# Altium schematic sheet MAIN.SchDoc
size A4; SheetNumber: 2; SheetTotal: 3
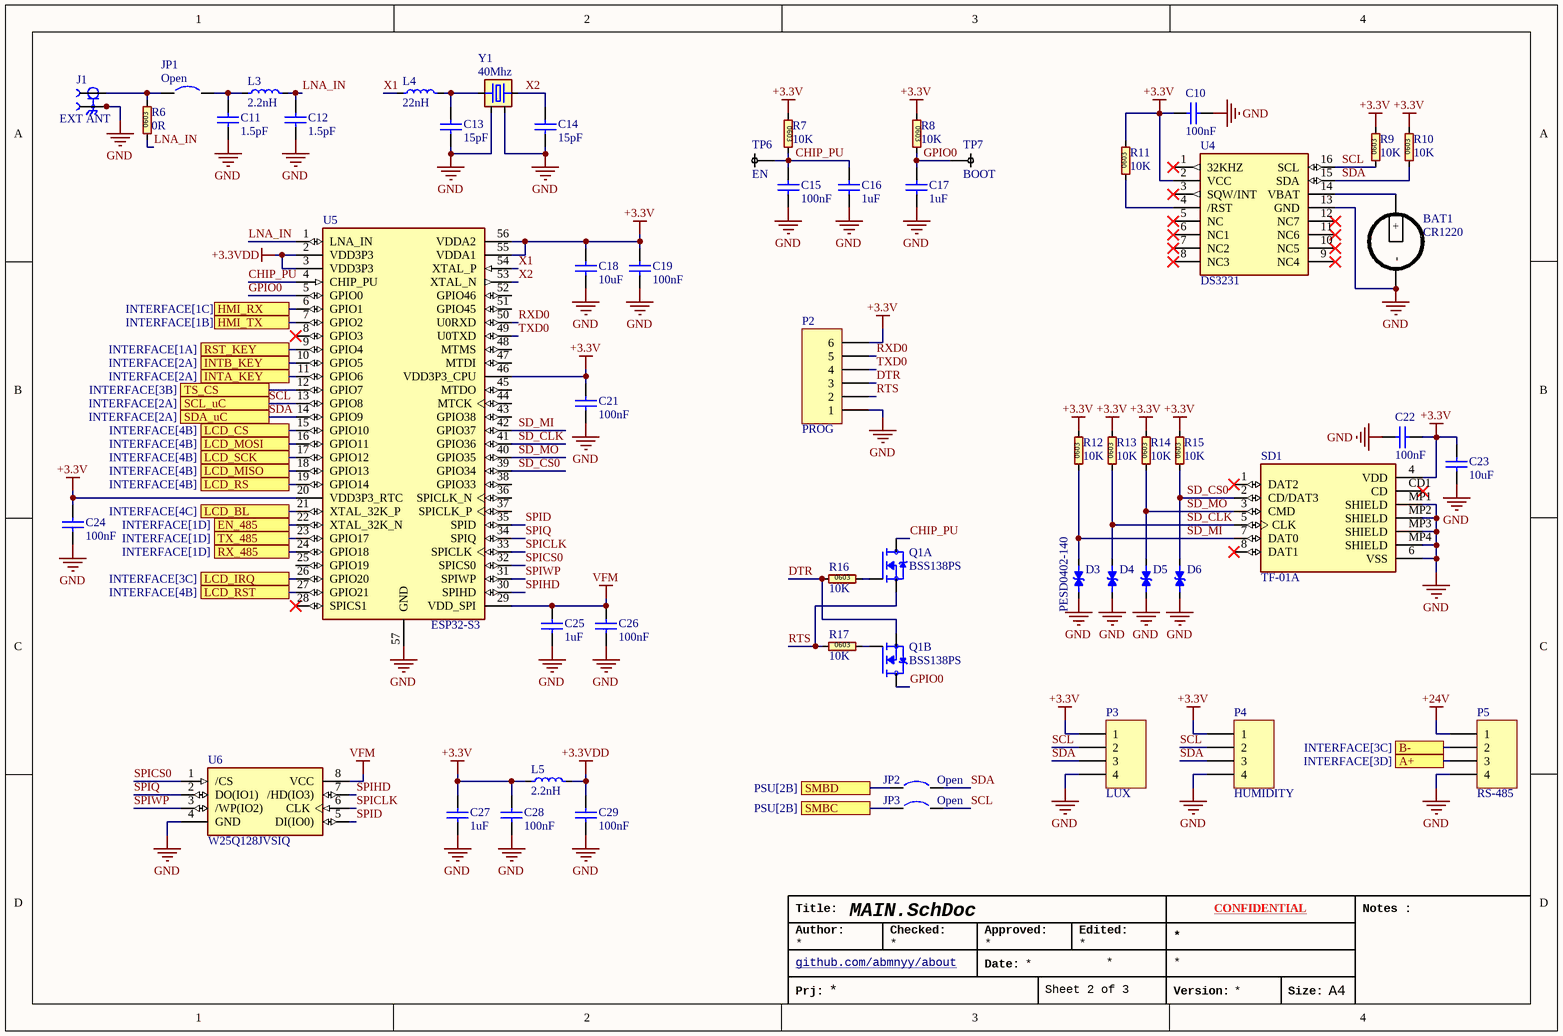
[diagram p0: MAIN.SchDoc]

## Parts
BAT1  CR1220  [MPD_BC501SM-TR]
C10  100nF  [C0603]
C11  1.5pF  [C0603]
C12  1.5pF  [C0603]
C13  15pF  [C0603]
C14  15pF  [C0603]
C15  100nF  [C0603]
C16  1uF  [C0603]
C17  1uF  [C0603]
C18  10uF  [C0603]
C19  100nF  [C0603]
C21  100nF  [C0603]
C22  100nF  [C0603]
C23  10uF  [C0603]
C24  100nF  [C0603]
C25  1uF  [C0603]
C26  100nF  [C0603]
C27  1uF  [C0603]
C28  100nF  [C0603]
C29  100nF  [C0603]
D3  PESD0402-140  [ESD0402]
D4  PESD0402-140  [ESD0402]  (value not drawn)
D5  PESD0402-140  [ESD0402]  (value not drawn)
D6  PESD0402-140  [ESD0402]  (value not drawn)
J1  EXT ANT  [IPEX_UF.L]
JP1  Open  [SB_STM]
JP2  Open  [SB_STM]
JP3  Open  [SB_STM]
L3  2.2nH  [L0603]
L4  22nH  [L0603]
L5  2.2nH  [L0603]
P2  PROG  [HDR-6P-2.54mm]
P3  LUX  [JST_XH-2.54]
P4  HUMIDITY  [JST_XH-2.54]
P5  RS-485  [JST_XH-2.54]
Q1  BSS138PS  [SOT-363]  (parts A,B of 2)
R6  0R  [R0603]
R7  10K  [R0603]
R8  10K  [R0603]
R9  10K  [R0603]
R10  10K  [R0603]
R11  10K  [R0603]
R12  10K  [R0603]
R13  10K  [R0603]
R14  10K  [R0603]
R15  10K  [R0603]
R16  10K  [R0603]
R17  10K  [R0603]
SD1  TF-01A  [TF-01A]
TP6  EN  [PAD]
TP7  BOOT  [PAD]
U4  DS3231  [SOIC-16-WIDE]
U5  ESP32-S3  [ESP32-S3]
U6  W25Q128JVSIQ  [SOIC-8-208miL]
Y1  40Mhz  [OSC_SMD3225-4]

## Ports
A+ (see INTERFACE[3D]), B- (see INTERFACE[3C]), EN_485 (see INTERFACE[1D]), HMI_RX (see INTERFACE[1C]), HMI_TX (see INTERFACE[1B]), INTA_KEY (see INTERFACE[2A]), INTB_KEY (see INTERFACE[2A]), LCD_BL (see INTERFACE[4C]), LCD_CS (see INTERFACE[4B]), LCD_IRQ (see INTERFACE[3C]), LCD_MISO (see INTERFACE[4B]), LCD_MOSI (see INTERFACE[4B]), LCD_RS (see INTERFACE[4B]), LCD_RST (see INTERFACE[4B]), LCD_SCK (see INTERFACE[4B]), RST_KEY (see INTERFACE[1A]), RX_485 (see INTERFACE[1D]), SCL_uC (see INTERFACE[2A]), SDA_uC (see INTERFACE[2A]), SMBC (see PSU[2B]), SMBD (see PSU[2B]), TS_CS (see INTERFACE[3B]), TX_485 (see INTERFACE[1D])

## Nets
+3.3V: C10.2 C18.2 C19.2 C21.2 C22.1 C23.2 C24.2 C27.2 C28.2 L5.1 P2.6 P3.1 P4.1 R7.1 R8.1 R9.2 R10.2 R11.2 R12.2 R13.2 R14.2 R15.2 SD1.4(VDD) U4.2(VCC) U5.20(VDD3P3_RTC) U5.46(VDD3P3_CPU) U5.55(VDDA1) U5.56(VDDA2)
+3.3VDD: C29.2 L5.2 U5.2(VDD3P3) U5.3(VDD3P3)
+24V: P5.1
GND: BAT1.- C10.1 C11.1 C12.1 C13.1 C14.1 C15.2 C16.2 C17.2 C18.1 C19.1 C21.1 C22.2 C23.1 C24.1 C25.1 C26.1 C27.1 C28.1 C29.1 D3.1 D4.1 D5.1 D6.1 J1.2(GROUND) J1.3(GROUND) P2.1 P3.4 P4.4 P5.4 SD1.6(VSS) SD1.MP1(SHIELD) SD1.MP2(SHIELD) SD1.MP3(SHIELD) SD1.MP4(SHIELD) U4.13(GND) U5.57(GND) U6.4(GND) Y1.2(GND) Y1.4(GND)
VFM: C25.2 C26.2 U5.29(VDD_SPI) U6.8(VCC)
A+: P5.3 ; port A+
B-: P5.2 ; port B-
CHIP_PU: C15.1 C16.1 Q1.6(D1) R7.2 TP6.1 U5.4(CHIP_PU)
DTR: P2.3 Q1.4(S2) R16.1
EN_485: U5.22(XTAL_32K_N) ; port EN_485
GPIO0: C17.1 Q1.3(D2) R8.2 TP7.1 U5.5(GPIO0)
HMI_RX: U5.6(GPIO1) ; port HMI_RX
HMI_TX: U5.7(GPIO2) ; port HMI_TX
INTA_KEY: U5.11(GPIO6) ; port INTA_KEY
INTB_KEY: U5.10(GPIO5) ; port INTB_KEY
LCD_BL: U5.21(XTAL_32K_P) ; port LCD_BL
LCD_CS: U5.15(GPIO10) ; port LCD_CS
LCD_IRQ: U5.26(GPIO20) ; port LCD_IRQ
LCD_MISO: U5.18(GPIO13) ; port LCD_MISO
LCD_MOSI: U5.16(GPIO11) ; port LCD_MOSI
LCD_RS: U5.19(GPIO14) ; port LCD_RS
LCD_RST: U5.27(GPIO21) ; port LCD_RST
LCD_SCK: U5.17(GPIO12) ; port LCD_SCK
LNA_IN: C12.2 L3.2 R6.1 U5.1(LNA_IN)
RST_KEY: U5.9(GPIO4) ; port RST_KEY
RTS: P2.2 Q1.1(S1) R17.1
RX_485: U5.24(GPIO18) ; port RX_485
RXD0: P2.5 U5.50(U0RXD)
SCL: JP3.2 P3.2 P4.2 R9.1 U4.16(SCL) U5.13(GPIO8) ; port SCL_uC
SD_CLK: D4.2 R13.1 SD1.5(CLK) U5.41(GPIO36)
SD_CS0: D6.2 R15.1 SD1.2(CD/DAT3) U5.39(GPIO34)
SD_MI: D3.2 R12.1 SD1.7(DAT0) U5.42(GPIO37)
SD_MO: D5.2 R14.1 SD1.3(CMD) U5.40(GPIO35)
SDA: JP2.2 P3.3 P4.3 R10.1 U4.15(SDA) U5.14(GPIO9) ; port SDA_uC
SMBC: JP3.1 ; port SMBC
SMBD: JP2.1 ; port SMBD
SPICLK: U5.33(SPICLK) U6.6(CLK)
SPICS0: U5.32(SPICS0) U6.1(/CS)
SPID: U5.35(SPID) U6.5(DI(IO0))
SPIHD: U5.30(SPIHD) U6.7(/HD(IO3))
SPIQ: U5.34(SPIQ) U6.2(DO(IO1))
SPIWP: U5.31(SPIWP) U6.3(/WP(IO2))
TS_CS: U5.12(GPIO7) ; port TS_CS
TX_485: U5.23(GPIO17) ; port TX_485
TXD0: P2.4 U5.49(U0TXD)
X1: L4.1 U5.54(XTAL_P)
X2: C14.2 U5.53(XTAL_N) Y1.3(OSC2)
NetBAT1_+: BAT1.+ U4.14(VBAT)
NetC11_2: C11.2 JP1.2 L3.1
NetC13_2: C13.2 L4.2 Y1.1(OSC1)
NetJ1_1: J1.1(SIGNAL) JP1.1 R6.2
NetQ1_2: Q1.2(G1) R16.2
NetQ1_5: Q1.5(G2) R17.2
NetR11_1: R11.1 U4.4(/RST)

Not connected (* = marked no-connect by the designer): SD1 1(DAT2)* 8(DAT1)* CD1(CD)*; U4 1(32KHZ)* 3(SQW/INT)* 5(NC)* 6(NC1)* 7(NC2)* 8(NC3)* 9(NC4)* 10(NC5)* 11(NC6)* 12(NC7)*; U5 8(GPIO3)* 25(GPIO19) 28(SPICS1)* 36(SPICLK_N) 37(SPICLK_P) 38(GPIO33) 43(GPIO38) 44(MTCK) 45(MTDO) 47(MTDI) 48(MTMS) 51(GPIO45) 52(GPIO46)

## Notes on the sheet
- Title:
- Author:
- Checked:
- Approved:
- Edited:
- CONFIDENTIAL
- Notes :
- Prj:
- github.com/abmnyy/about <https://github.com/abmnyy/about>
- Date:
- Version:
- Size:
- A4
- (in symbol Resistor 0603 (Inch)) 0603

## Library data of the parts
BAT1 = CR1220 HOLDER: BATTERY HOLDER; MFR.Part #: BC501SM; LCSC Part #: C5439670; ComponentLink1Description: Datasheet; ComponentLink1URL: https://www.lcsc.com/datasheet/lcsc_datasheet_2410121528_MPD--Memory-Protection-Devices-BC501SM_C5439670.pdf
C10 C15 C19 C21-C29 = Capacitor 0603 (Inch): 0603 SMD Non-Polarity Capacitor; MFR.Part #: *; LCSC Part #: *; ComponentLink1Description: Datasheet; ComponentLink1URL: *
C11 C12 = Capacitor 0603 (Inch): 0603 SMD Non-Polarity Capacitor; MFR.Part #: CC0603CRNPO9BN1R5; LCSC Part #: C163551; ComponentLink1Description: Datasheet
  C11: ComponentLink1URL: https://www.lcsc.com/datasheet/C163551.pdf
  C12: ComponentLink1URL: *
C13 C14 = Capacitor 0603 (Inch): 0603 SMD Non-Polarity Capacitor; MFR.Part #: X322540MPB4SI; LCSC Part #: C9010; ComponentLink1Description: Datasheet
  C13: ComponentLink1URL: https://www.lcsc.com/datasheet/C9010.pdf
  C14: ComponentLink1URL: *
C16 C17 = Capacitor 0603 (Inch): 0603 SMD Non-Polarity Capacitor; MFR.Part #: CC0603KRX7R7BB105; LCSC Part #: C106248; ComponentLink1Description: Datasheet; ComponentLink1URL: *
C18 = Capacitor 0603 (Inch): 0603 SMD Non-Polarity Capacitor; MFR.Part #: CC0603MRX5R7BB106; LCSC Part #: C109457; ComponentLink1Description: Datasheet; ComponentLink1URL: *
D3-D6 = PESD0402-140: 40V Bidirectional 14V 0402 ESD and Surge Protection (TVS/ESD) ROHS; MFR.Part #: PESD0402-140; LCSC Part #: C10662
  D3: ComponentLink1Description: Datasheet; ComponentLink1URL: https://www.lcsc.com/datasheet/C10662.pdf
J1 = IPEX UF.L: 1 POS Vertical SMD Small form factor with big performance through 6 GHz connector,MHF, RF, micro-coaxial MHF I Receptacle; MFR.Part #: KH-IPEX-K501-29; LCSC Part #: C411563; ComponentLink1Description: Datasheet; ComponentLink1URL: https://www.lcsc.com/datasheet/C411563.pdf
JP1-JP3 = Jumper Solder: Jumper Solder Pad; Published: 24-Mar-1999; Revision: July-2002: Re-released for DXP Platform.; Publisher: Altium Limited
L3 = INDUCTOR 0603: Inductor with Package: 0603 Inch; MFR.Part #: *; LCSC Part #: *; ComponentLink1Description: Datasheet; ComponentLink1URL: *
L4 = INDUCTOR 0603: Inductor with Package: 0603 Inch; MFR.Part #: VHF160808H22NJT; LCSC Part #: C90207; ComponentLink1Description: Datasheet; ComponentLink1URL: https://www.lcsc.com/datasheet/C90207.pdf
L5 = INDUCTOR 0603: Inductor with Package: 0603 Inch; MFR.Part #: LQW18AN2N2C80D; LCSC Part #: C71648; ComponentLink1Description: Datasheet; ComponentLink1URL: https://www.lcsc.com/datasheet/C71648.pdf
P2 = Header 6: Header, 6-Pin; LatestRevisionDate: 17-Jul-2002; LatestRevisionNote: Re-released for DXP Platform.; Publisher: Altium Limited
P3-P5 = Connector 4P: CONNECTOR HEADER; LatestRevisionDate: 17-Jul-2002; LatestRevisionNote: Re-released for DXP Platform.; Publisher: Altium Limited
Q1 = BSS138PS: 60 V, 320 mA dual N-channel Trench MOSFET; MFR.Part #: BSS138PS,115; LCSC Part #: C193381; ComponentLink1Description: Datasheet; ComponentLink1URL: https://www.lcsc.com/datasheet/lcsc_datasheet_2410121736_Nexperia-BSS138PS-115_C193381.pdf
R6 = Resistor 0603 (Inch): 0603 SMD Thick Resistor; MFR.Part #: AC0603FR-070RL; LCSC Part #: C116699; ComponentLink1Description: Datasheet; ComponentLink1URL: *
R7-R17 = Resistor 0603 (Inch): 0603 SMD Thick Resistor; MFR.Part #: *; LCSC Part #: *; ComponentLink1Description: Datasheet; ComponentLink1URL: *
SD1 = TF-01A: Standard Card Edge Connectors; LCSC Part #: C2889258; MFR.Part #: TF-01A; ComponentLink1Description: Datasheet; ComponentLink1URL: https://www.lcsc.com/datasheet/C2889258.pdf
TP6 TP7 = Test Point: Thick Pad
U4 = DS3231: Real Time Clock (RTC) IC Clock/Calendar - IÂ²C, 2-Wire Serial 8-SOIC (0.154, 3.90mm Width); MFR.Part #: DS3231SN#T&R; LCSC Part #: C9866; ComponentLink1Description: Datasheet; ComponentLink1URL: https://www.lcsc.com/datasheet/C9866.pdf
U5 = ESP32-S3: IC RF TxRx + MCU Bluetooth, WiFi 802.11b/g/n, Bluetooth v5.0 2.412GHz ~ 2.484GHz 56-VFQFN Exposed Pad; MFR.Part #: ESP32-S3R8; LCSC Part #: C2913194; ComponentLink1Description: Datasheet; ComponentLink1URL: https://www.lcsc.com/datasheet/C2913194.pdf
U6 = W25Q128JVSIQ: FLASH - NOR Memory IC 128Mb (16M x 8) SPI - Quad I/O, QPI, DTR 133 MHz 8-SOIC; MFR.Part #: W25Q128JVSIQ; LCSC Part #: C97521; ComponentLink1Description: Datasheet; ComponentLink1URL: https://www.lcsc.com/datasheet/C97521.pdf
Y1 = XTAL-40Mhz: 40MHz Crystal Oscillator 15pF ±10ppm ±20ppm SMD3225-4P Crystals ROHS; MFR.Part #: X322540MPB4SI; LCSC Part #: C9010; ComponentLink1Description: Datasheet; ComponentLink1URL: https://www.lcsc.com/datasheet/C9010.pdf